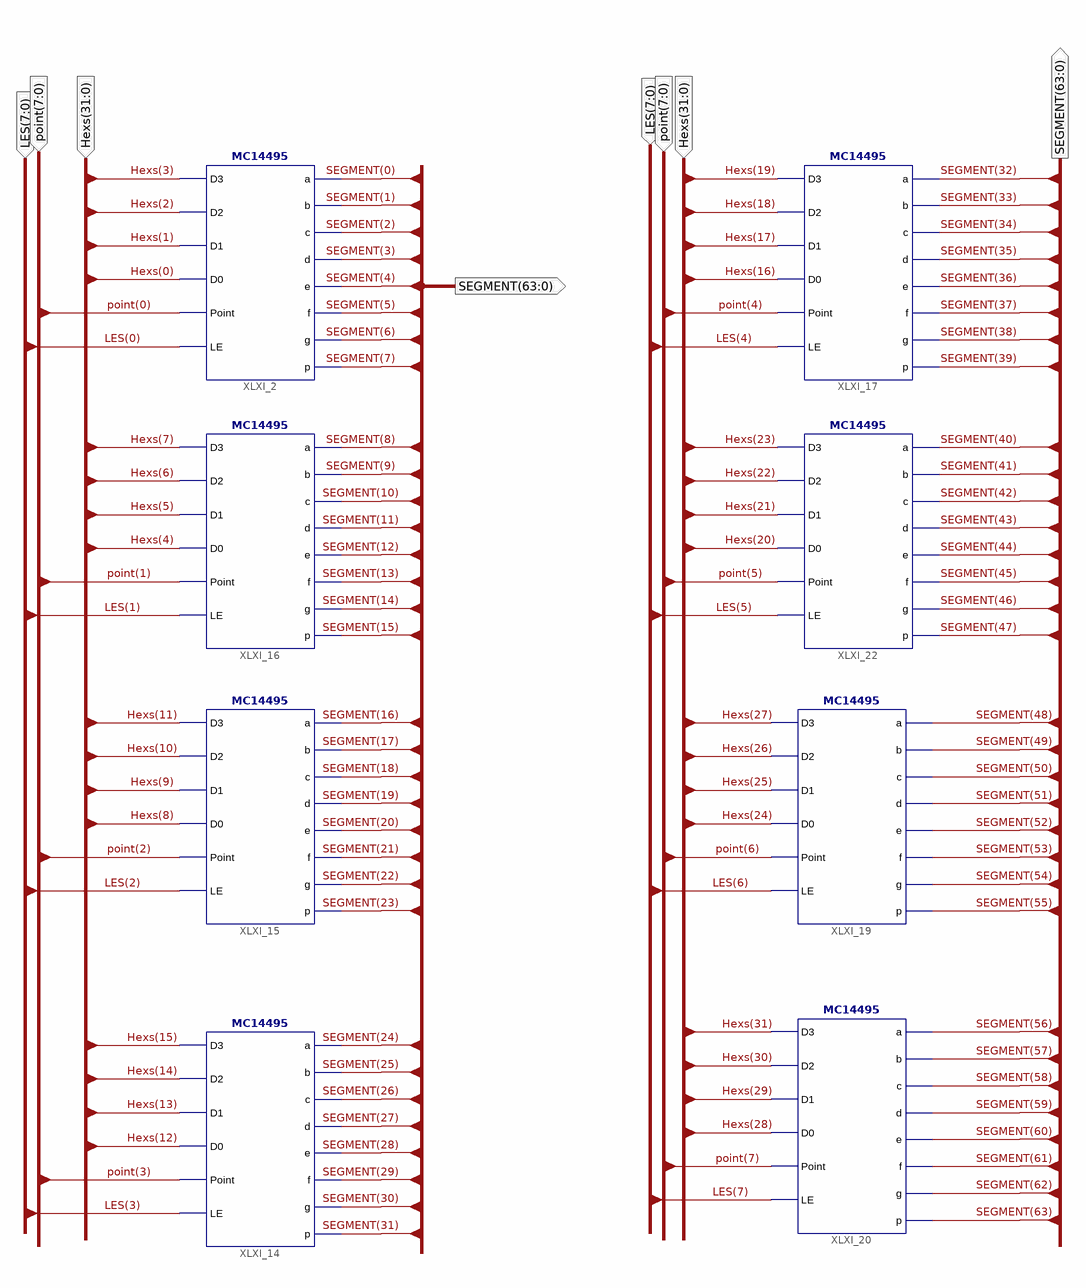
[diagram p0: schematic sheet 1]
// Xilinx ISE schematic Seg7_Dev16.sch (kintex7) as structural Verilog: 8 symbols, 4 ports
module Seg7_Dev16 (
  input  [7:0] LES,
  input  [7:0] point,
  input  [31:0] Hexs,
  output [63:0] SEGMENT
);

  MC14495 XLXI_22 (
    .D3(Hexs[23]), .D2(Hexs[22]), .D1(Hexs[21]), .D0(Hexs[20]), .Point(point[5]), .LE(LES[5]),
    .a(SEGMENT[40]), .b(SEGMENT[41]), .c(SEGMENT[42]), .d(SEGMENT[43]), .e(SEGMENT[44]), .f(SEGMENT[45]),
    .g(SEGMENT[46]), .p(SEGMENT[47]));
  MC14495 XLXI_15 (
    .D3(Hexs[11]), .D2(Hexs[10]), .D1(Hexs[9]), .D0(Hexs[8]), .Point(point[2]), .LE(LES[2]), .a(SEGMENT[16]),
    .b(SEGMENT[17]), .c(SEGMENT[18]), .d(SEGMENT[19]), .e(SEGMENT[20]), .f(SEGMENT[21]), .g(SEGMENT[22]),
    .p(SEGMENT[23]));
  MC14495 XLXI_16 (
    .D3(Hexs[7]), .D2(Hexs[6]), .D1(Hexs[5]), .D0(Hexs[4]), .Point(point[1]), .LE(LES[1]), .a(SEGMENT[8]),
    .b(SEGMENT[9]), .c(SEGMENT[10]), .d(SEGMENT[11]), .e(SEGMENT[12]), .f(SEGMENT[13]), .g(SEGMENT[14]),
    .p(SEGMENT[15]));
  MC14495 XLXI_20 (
    .D3(Hexs[31]), .D2(Hexs[30]), .D1(Hexs[29]), .D0(Hexs[28]), .Point(point[7]), .LE(LES[7]),
    .a(SEGMENT[56]), .b(SEGMENT[57]), .c(SEGMENT[58]), .d(SEGMENT[59]), .e(SEGMENT[60]), .f(SEGMENT[61]),
    .g(SEGMENT[62]), .p(SEGMENT[63]));
  MC14495 XLXI_19 (
    .D3(Hexs[27]), .D2(Hexs[26]), .D1(Hexs[25]), .D0(Hexs[24]), .Point(point[6]), .LE(LES[6]),
    .a(SEGMENT[48]), .b(SEGMENT[49]), .c(SEGMENT[50]), .d(SEGMENT[51]), .e(SEGMENT[52]), .f(SEGMENT[53]),
    .g(SEGMENT[54]), .p(SEGMENT[55]));
  MC14495 XLXI_17 (
    .D3(Hexs[19]), .D2(Hexs[18]), .D1(Hexs[17]), .D0(Hexs[16]), .Point(point[4]), .LE(LES[4]),
    .a(SEGMENT[32]), .b(SEGMENT[33]), .c(SEGMENT[34]), .d(SEGMENT[35]), .e(SEGMENT[36]), .f(SEGMENT[37]),
    .g(SEGMENT[38]), .p(SEGMENT[39]));
  MC14495 XLXI_14 (
    .D3(Hexs[15]), .D2(Hexs[14]), .D1(Hexs[13]), .D0(Hexs[12]), .Point(point[3]), .LE(LES[3]),
    .a(SEGMENT[24]), .b(SEGMENT[25]), .c(SEGMENT[26]), .d(SEGMENT[27]), .e(SEGMENT[28]), .f(SEGMENT[29]),
    .g(SEGMENT[30]), .p(SEGMENT[31]));
  MC14495 XLXI_2 (
    .D3(Hexs[3]), .D2(Hexs[2]), .D1(Hexs[1]), .D0(Hexs[0]), .Point(point[0]), .LE(LES[0]), .a(SEGMENT[0]),
    .b(SEGMENT[1]), .c(SEGMENT[2]), .d(SEGMENT[3]), .e(SEGMENT[4]), .f(SEGMENT[5]), .g(SEGMENT[6]),
    .p(SEGMENT[7]));
endmodule
